# Altium schematic sheet LED_ring.SchDoc: LED
size B; DrawnBy: Ben Peng; Organization: Altium Limited; Address1: L3, 12a Rodborough Rd; Address2: Frenchs Forest; Address3: NSW; Address4: Australia 2086; DocumentNumber: 6; SheetNumber: 6; SheetTotal: 9
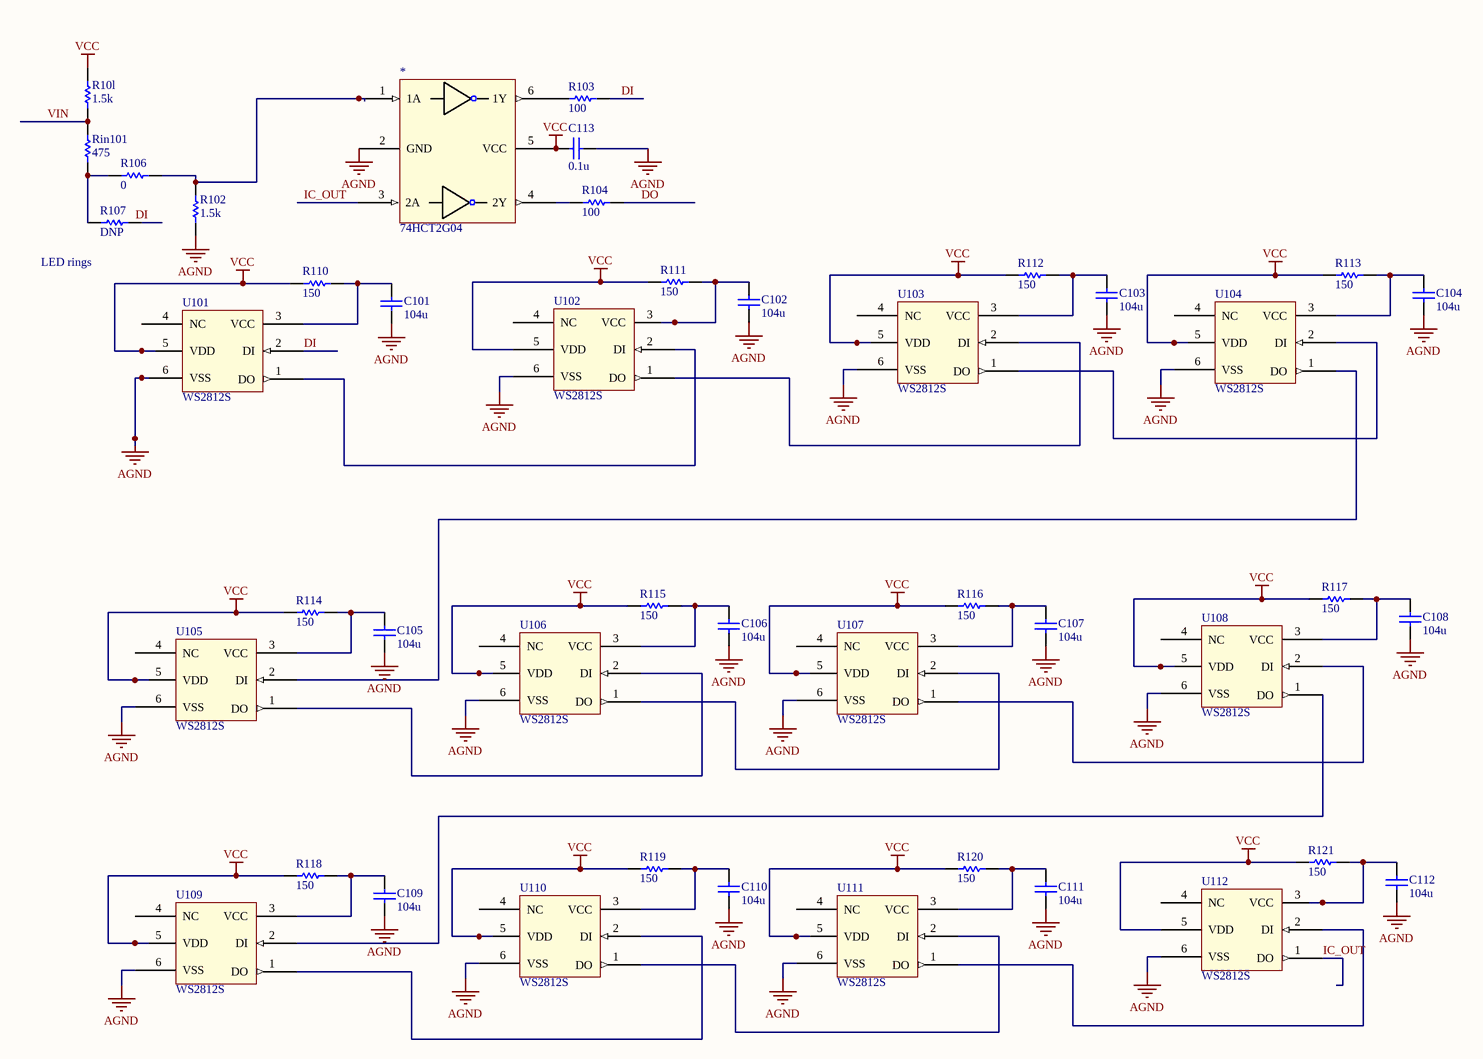
[diagram p0: LED_ring.SchDoc]

## Parts
*  74HCT2G04  [SOT363-6M]
C101  104u  [CAP0603_SENSE_DVT]
C102  104u  [CAP0603_SENSE_DVT]
C103  104u  [CAP0603_SENSE_DVT]
C104  104u  [CAP0603_SENSE_DVT]
C105  104u  [CAP0603_SENSE_DVT]
C106  104u  [CAP0603_SENSE_DVT]
C107  104u  [CAP0603_SENSE_DVT]
C108  104u  [CAP0603_SENSE_DVT]
C109  104u  [CAP0603_SENSE_DVT]
C110  104u  [CAP0603_SENSE_DVT]
C111  104u  [CAP0603_SENSE_DVT]
C112  104u  [CAP0603_SENSE_DVT]
C113  0.1u  [CAP0402_SENSE_DVT]
R10l  1.5k  [RES0402_SENSE_DVT]
R102  1.5k  [RES0402_SENSE_DVT]
R103  100  [RES0402_SENSE_DVT]
R104  100  [RES0402_SENSE_DVT]
R106  0  [RES0402_SENSE_DVT]
R107  DNP  [RES0402_SENSE_DVT]
R110  150  [RES0402_SENSE_DVT]
R111  150  [RES0402_SENSE_DVT]
R112  150  [RES0402_SENSE_DVT]
R113  150  [RES0402_SENSE_DVT]
R114  150  [RES0402_SENSE_DVT]
R115  150  [RES0402_SENSE_DVT]
R116  150  [RES0402_SENSE_DVT]
R117  150  [RES0402_SENSE_DVT]
R118  150  [RES0402_SENSE_DVT]
R119  150  [RES0402_SENSE_DVT]
R120  150  [RES0402_SENSE_DVT]
R121  150  [RES0402_SENSE_DVT]
Rin101  475  [RES0402_SENSE_DVT]
U101  WS2812S  [6PIN_WS2812]
U102  WS2812S  [6PIN_WS2812]
U103  WS2812S  [6PIN_WS2812]
U104  WS2812S  [6PIN_WS2812]
U105  WS2812S  [6PIN_WS2812]
U106  WS2812S  [6PIN_WS2812]
U107  WS2812S  [6PIN_WS2812]
U108  WS2812S  [6PIN_WS2812]
U109  WS2812S  [6PIN_WS2812]
U110  WS2812S  [6PIN_WS2812]
U111  WS2812S  [6PIN_WS2812]
U112  WS2812S  [6PIN_WS2812]

## Nets
AGND: *.2(GND) C101.1 C102.1 C103.1 C104.1 C105.1 C106.1 C107.1 C108.1 C109.1 C110.1 C111.1 C112.1 C113.2 R102.1 U101.6(VSS) U102.6(VSS) U103.6(VSS) U104.6(VSS) U105.6(VSS) U106.6(VSS) U107.6(VSS) U108.6(VSS) U109.6(VSS) U110.6(VSS) U111.6(VSS) U112.6(VSS)
VCC: *.5(VCC) C113.1 R10l.2 R110.2 R111.2 R112.2 R113.2 R114.2 R115.2 R116.2 R117.2 R118.2 R119.2 R120.2 R121.2 U101.5(VDD) U102.5(VDD) U103.5(VDD) U104.5(VDD) U105.5(VDD) U106.5(VDD) U107.5(VDD) U108.5(VDD) U109.5(VDD) U110.5(VDD) U111.5(VDD) U112.5(VDD)
DI: R103.2 U101.2(DI)
DO: R104.2
IC_OUT: *.3(2A) U112.1(DO)
VIN: R10l.1 Rin101.2
Net*_1: *.1(1A) R102.2 R106.2
Net*_4: *.4(2Y) R104.1
Net*_6: *.6(1Y) R103.1
NetC101_2: C101.2 R110.1 U101.3(VCC)
NetC102_2: C102.2 R111.1 U102.3(VCC)
NetC103_2: C103.2 R112.1 U103.3(VCC)
NetC104_2: C104.2 R113.1 U104.3(VCC)
NetC105_2: C105.2 R114.1 U105.3(VCC)
NetC106_2: C106.2 R115.1 U106.3(VCC)
NetC107_2: C107.2 R116.1 U107.3(VCC)
NetC108_2: C108.2 R117.1 U108.3(VCC)
NetC109_2: C109.2 R118.1 U109.3(VCC)
NetC110_2: C110.2 R119.1 U110.3(VCC)
NetC111_2: C111.2 R120.1 U111.3(VCC)
NetC112_2: C112.2 R121.1 U112.3(VCC)
NetR106_1: R106.1 R107.1 Rin101.1
NetU101_1: U101.1(DO) U102.2(DI)
NetU102_1: U102.1(DO) U103.2(DI)
NetU103_1: U103.1(DO) U104.2(DI)
NetU104_1: U104.1(DO) U105.2(DI)
NetU105_1: U105.1(DO) U106.2(DI)
NetU106_1: U106.1(DO) U107.2(DI)
NetU107_1: U107.1(DO) U108.2(DI)
NetU108_1: U108.1(DO) U109.2(DI)
NetU109_1: U109.1(DO) U110.2(DI)
NetU110_1: U110.1(DO) U111.2(DI)
NetU111_1: U111.1(DO) U112.2(DI)

Not connected (* = marked no-connect by the designer): R107 2; U101 4(NC); U102 4(NC); U103 4(NC); U104 4(NC); U105 4(NC); U106 4(NC); U107 4(NC); U108 4(NC); U109 4(NC); U110 4(NC); U111 4(NC); U112 4(NC)

## Notes on the sheet
- (near R107) LED rings
- Labels drawn without touching a wire or pin: DI
- Title
- Size:
- Date:
- B
- Number:
- Time:
- Revision:
- Sheet
- of
- File:

## Library data of the parts
* = 74HCT2G04: Dual inverter The 74HC2G04; 74HCT2G04 is a high-speed Si-gate CMOS device.
C101-C112 = C_10u_10_6.3_X5R_0603: Chip capacitor; Value: 10u; Vendor: TDK; PN: C1608X5R0J106K080AB; Tolerance: 10%; Voltage: 6.3V; Temp: X5R; Size: 0603
C113 = C_0.1u_10_50_X7R_0402: Chip capacitor; Vendor: Taiyo Yuden; PN: UMK105B7104KV-FR; Tolerance: 10%; Voltage: 50V; Temp: X7R; Value: 0.1u; Size: 0402
R10l R102 = R_1.5k_5_0.1_0402: Chip Resistor; Vendor: Panasonic; Tolerance: 5 %; Power: 0.1 W; PN: ERJ-2GEJ152X; Model: *; Value: 1.5k; Size: 0402
R103 R104 = R_100_1_0.1_0402: Chip Resistor; Vendor: Panasonic; Tolerance: 1 %; Power: 0.1 W; PN: ERJ-2RKF1000X; Model: *; Value: 100; Size: 0402
R106 = R_0_jumper_0.1_0402: Chip Resistor; Vendor: Panasonic; Tolerance: Jumper; Power: 0.1 W; PN: ERJ-2GE0R00X; Model: *; Value: 0; Size: 0402
R107 = R_0_jumper_0.1_0402: Chip Resistor; Value: 0; Vendor: Panasonic; Tolerance: Jumper; Power: 0.1 W; PN: ERJ-2GE0R00X; Model: *; Size: 0402
R110-R121 = R_150_1_0.1_0402: Chip Resistor; Vendor: Panasonic; Tolerance: 1 %; Power: 0.1 W; PN: ERJ-2RKF1500X; Model: *; Value: 150; Size: 0402
Rin101 = R_475_1_0.1_0402: Chip Resistor; Vendor: Panasonic; Tolerance: 1 %; Power: 0.1 W; PN: ERJ-2RKF4750X; Model: *; Value: 475; Size: 0402
U101-U112 = WS2812: WS2812 Intelligent control LED integrated light source